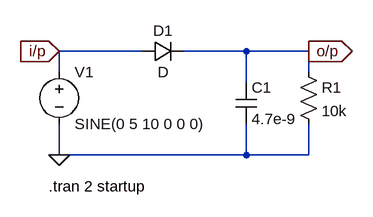
[diagram p0: schematic 1.Half Wave Rectifier.asc]
1.Half Wave Rectifier.asc, the LTspice schematic file:
Version 4
SHEET 1 880 680
WIRE 128 112 0 112
WIRE 288 112 192 112
WIRE 384 112 288 112
WIRE 0 144 0 112
WIRE 384 144 384 112
WIRE 288 160 288 112
WIRE 0 272 0 224
WIRE 288 272 288 224
WIRE 288 272 0 272
WIRE 384 272 384 224
WIRE 384 272 288 272
FLAG 0 272 0
FLAG 0 112 i/p
IOPIN 0 112 In
FLAG 384 112 o/p
IOPIN 384 112 Out
SYMBOL diode 128 128 R270
WINDOW 0 32 32 VTop 2
WINDOW 3 0 32 VBottom 2
SYMATTR InstName D1
SYMBOL res 368 128 R0
SYMATTR InstName R1
SYMATTR Value 10k
SYMBOL voltage 0 128 R0
WINDOW 123 0 0 Left 0
WINDOW 39 0 0 Left 0
SYMATTR InstName V1
SYMATTR Value SINE(0 5 10 0 0 0)
SYMBOL cap 272 160 R0
SYMATTR InstName C1
SYMATTR Value 4.7e-9
TEXT -16 320 Left 2 !.tran 2 startup

The netlist it stands for:
* 1.Half Wave Rectifier.asc
D1 i/p o/p D
R1 o/p 0 10k
V1 i/p 0 SINE(0 5 10 0 0 0)
C1 o/p 0 4.7e-9
.model D D
.lib standard.dio
.tran 2 startup
.backanno
.end